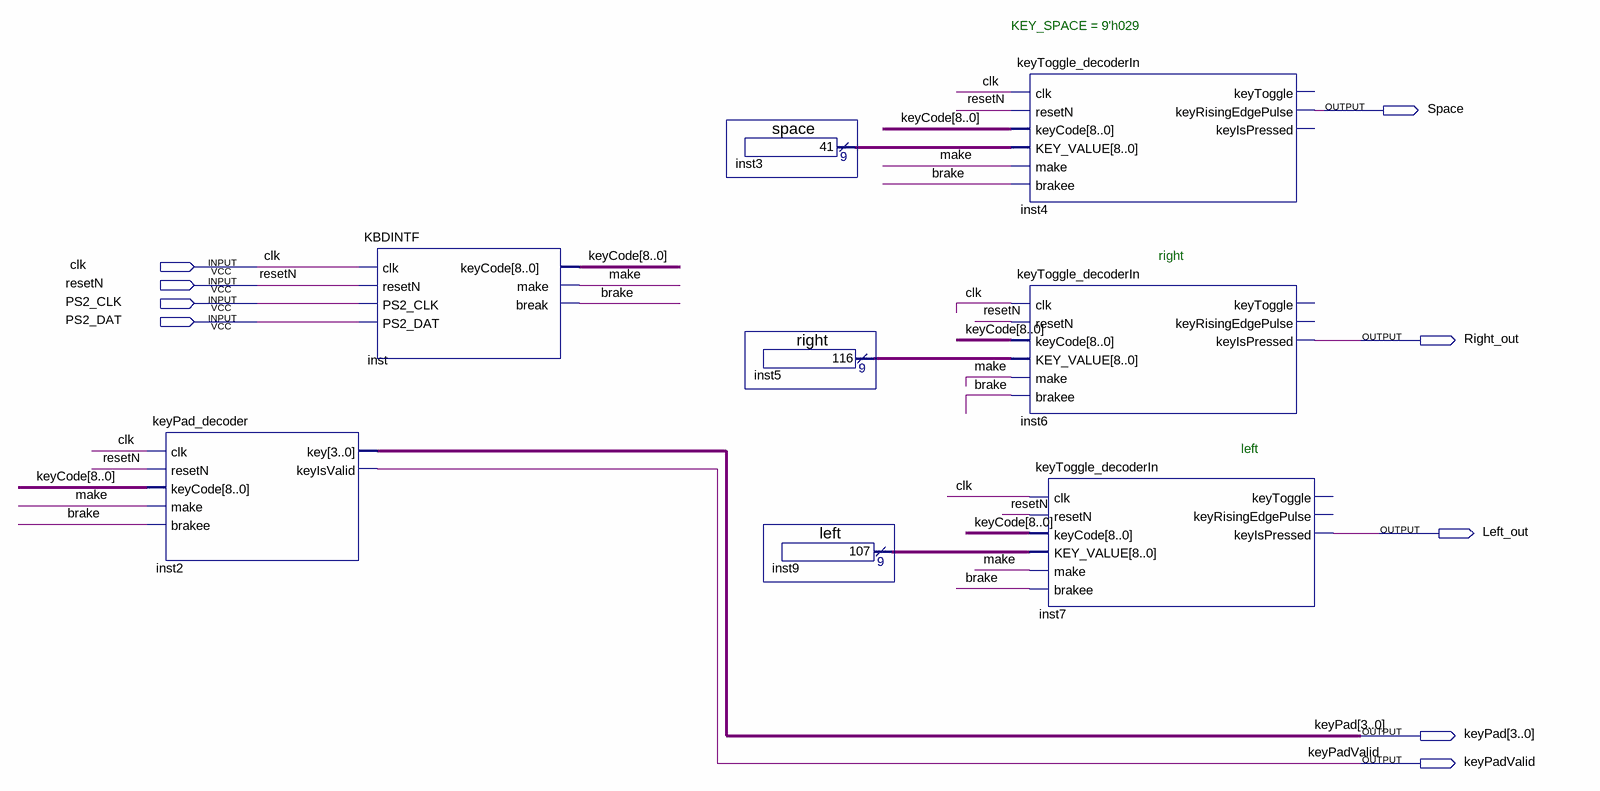
[diagram p0: schematic sheet]
// Quartus schematic TOP_KBD_DEMOALL.bdf as structural Verilog: 8 symbols, 9 pins
module TOP_KBD_DEMOALL (
  input  clk,
  input  resetN,
  input  PS2_CLK,
  input  PS2_DAT,
  output Space,
  output Right_out,
  output Left_out,
  output [3:0] keyPad,
  output keyPadValid
);

  wire brake, make;
  wire [8:0] inst3_result, inst5_result, inst9_result, keyCode;

  keyPad_decoder inst2 (
    .clk(clk), .resetN(resetN), .keyCode(keyCode), .make(make), .brakee(brake), .key(keyPad),
    .keyIsValid(keyPadValid));
  KBDINTF inst (
    .clk(clk), .resetN(resetN), .PS2_CLK(PS2_CLK), .PS2_DAT(PS2_DAT), .keyCode(keyCode), .make(make),
    .\break (brake));
  space inst3 (.result(inst3_result));
  right inst5 (.result(inst5_result));
  left inst9 (.result(inst9_result));
  keyToggle_decoderIn inst4 (
    .clk(clk), .resetN(resetN), .keyCode(keyCode), .KEY_VALUE(inst3_result), .make(make), .brakee(brake),
    .keyRisingEdgePulse(Space));  // open: keyToggle, keyIsPressed
  keyToggle_decoderIn inst6 (
    .clk(clk), .resetN(resetN), .keyCode(keyCode), .KEY_VALUE(inst5_result), .make(make), .brakee(brake),
    .keyIsPressed(Right_out));  // open: keyToggle, keyRisingEdgePulse
  keyToggle_decoderIn inst7 (
    .clk(clk), .resetN(resetN), .keyCode(keyCode), .KEY_VALUE(inst9_result), .make(make), .brakee(brake),
    .keyIsPressed(Left_out));  // open: keyToggle, keyRisingEdgePulse

  // Notes on the sheet:
  //   KEY_SPACE = 9'h029
  //   right
  //   left
endmodule
